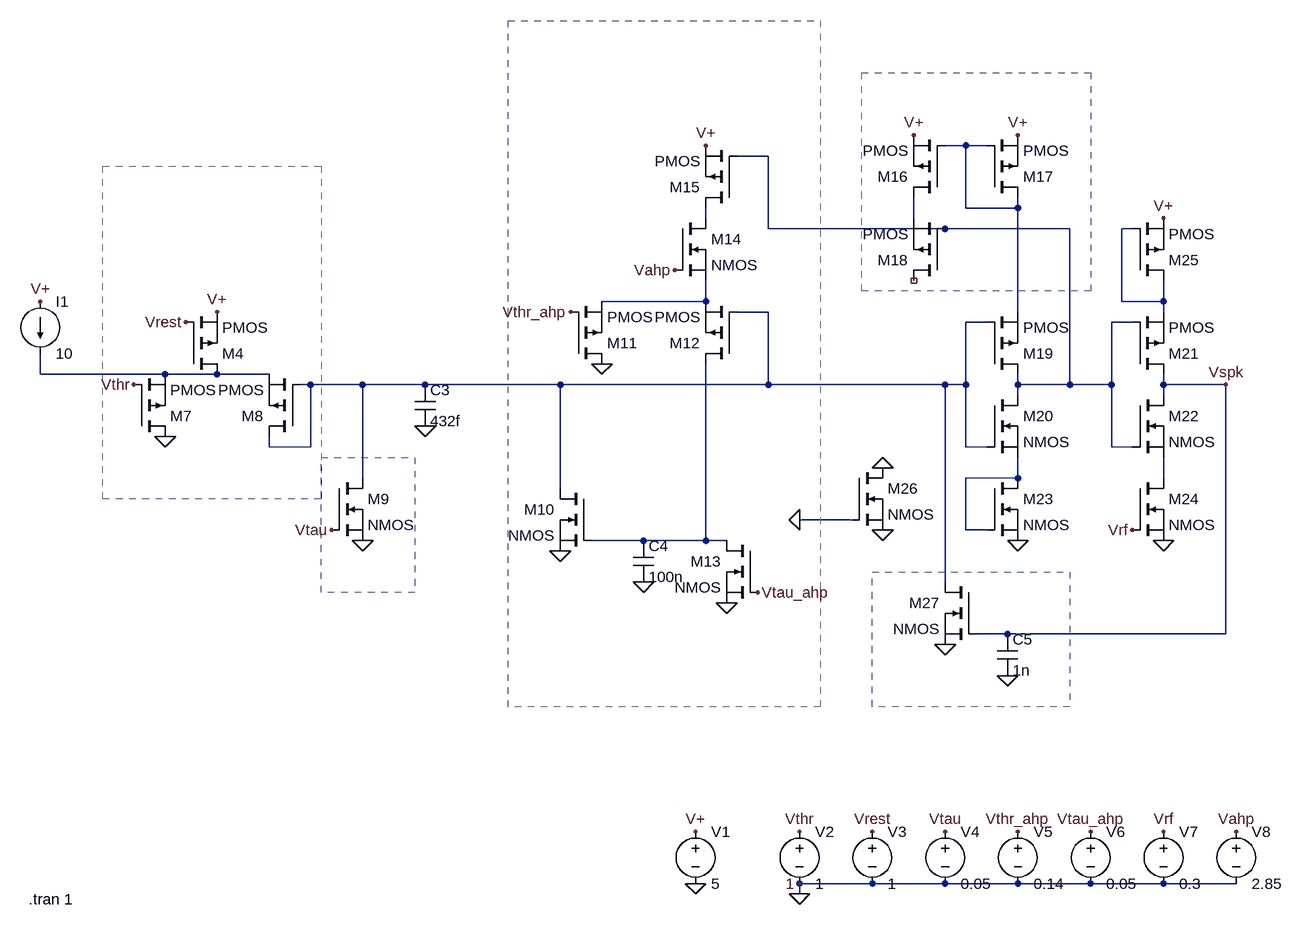
[diagram p0: schematic indiveri.asc]
indiveri.asc, the LTspice schematic file:
Version 4
SHEET 1 2744 860
WIRE 2256 -336 2224 -336
WIRE 2288 -336 2256 -336
WIRE 1952 -320 1904 -320
WIRE 2256 -240 2256 -336
WIRE 2336 -240 2336 -256
WIRE 2336 -240 2256 -240
WIRE 1856 -224 1856 -240
WIRE 2176 -224 2176 -256
WIRE 1952 -208 1952 -320
WIRE 2224 -208 1952 -208
WIRE 2416 -208 2224 -208
WIRE 2512 -208 2496 -208
WIRE 1856 -96 1856 -128
WIRE 1856 -96 1696 -96
WIRE 2496 -96 2496 -208
WIRE 2560 -96 2560 -128
WIRE 2560 -96 2496 -96
WIRE 1952 -80 1904 -80
WIRE 2336 -80 2336 -240
WIRE 2560 -80 2560 -96
WIRE 2288 -64 2256 -64
WIRE 2512 -64 2480 -64
WIRE 832 16 832 -16
WIRE 1024 16 832 16
WIRE 1104 16 1024 16
WIRE 1184 16 1104 16
WIRE 1248 32 1232 32
WIRE 1328 32 1248 32
WIRE 1424 32 1328 32
WIRE 1632 32 1424 32
WIRE 1952 32 1952 -80
WIRE 1952 32 1632 32
WIRE 2224 32 1952 32
WIRE 2256 32 2256 -64
WIRE 2256 32 2224 32
WIRE 2336 32 2336 16
WIRE 2416 32 2416 -208
WIRE 2416 32 2336 32
WIRE 2480 32 2480 -64
WIRE 2480 32 2416 32
WIRE 2560 32 2560 16
WIRE 2656 32 2560 32
WIRE 2336 48 2336 32
WIRE 2560 48 2560 32
WIRE 1184 128 1184 112
WIRE 1248 128 1248 32
WIRE 1248 128 1184 128
WIRE 2256 128 2256 32
WIRE 2288 128 2256 128
WIRE 2480 128 2480 32
WIRE 2512 128 2480 128
WIRE 1328 176 1328 32
WIRE 2336 176 2336 144
WIRE 2336 176 2256 176
WIRE 2560 176 2560 144
WIRE 1632 192 1632 32
WIRE 2080 240 2000 240
WIRE 2256 256 2256 176
WIRE 2288 256 2256 256
WIRE 1760 272 1680 272
WIRE 1856 272 1856 0
WIRE 1856 272 1760 272
WIRE 1888 272 1856 272
WIRE 2224 336 2224 32
WIRE 2320 416 2272 416
WIRE 2656 416 2656 32
WIRE 2656 416 2320 416
WIRE 2112 800 2000 800
WIRE 2224 800 2112 800
WIRE 2336 800 2224 800
WIRE 2448 800 2336 800
WIRE 2560 800 2448 800
WIRE 2672 800 2560 800
WIRE 2000 816 2000 800
FLAG 1424 96 0
FLAG 1760 336 0
FLAG 1888 368 0
FLAG 1632 288 0
FLAG 1696 0 0
FLAG 1024 112 0
FLAG 1328 272 0
FLAG 2336 272 0
FLAG 2560 272 0
FLAG 2128 256 0
FLAG 2224 432 0
FLAG 2320 480 0
FLAG 1840 800 0
FLAG 1840 720 V+
FLAG 832 -96 V+
FLAG 1104 -80 V+
FLAG 1856 -336 V+
FLAG 2176 -352 V+
FLAG 2336 -352 V+
FLAG 2560 -224 V+
FLAG 2128 160 0
FLAG 2000 800 1
FLAG 2000 720 Vthr
FLAG 2112 720 Vrest
FLAG 2224 720 Vtau
FLAG 2336 720 Vthr_ahp
FLAG 2448 720 Vtau_ahp
FLAG 2560 720 Vrf
FLAG 2672 720 Vahp
FLAG 976 32 Vthr
FLAG 1056 -64 Vrest
FLAG 1280 256 Vtau
FLAG 1648 -80 Vthr_ahp
FLAG 1936 352 Vtau_ahp
FLAG 2512 256 Vrf
FLAG 2656 32 Vspk
FLAG 1808 -144 Vahp
FLAG 2000 816 0
FLAG 2000 240 0
SYMBOL pmos 1056 16 M180
SYMATTR InstName M4
SYMBOL pmos 976 112 M180
SYMATTR InstName M7
SYMBOL pmos 1232 112 R180
SYMATTR InstName M8
SYMBOL nmos 1280 176 R0
SYMATTR InstName M9
SYMBOL nmos 1680 192 M0
SYMATTR InstName M10
SYMBOL pmos 1648 0 M180
SYMATTR InstName M11
SYMBOL pmos 1904 0 R180
SYMATTR InstName M12
SYMBOL cap 1408 32 R0
SYMATTR InstName C3
SYMATTR Value 432f
SYMBOL cap 1744 272 R0
SYMATTR InstName C4
SYMATTR Value 100n
SYMBOL nmos 1936 272 M0
SYMATTR InstName M13
SYMBOL nmos 1808 -224 R0
SYMATTR InstName M14
SYMBOL pmos 1904 -240 R180
SYMATTR InstName M15
SYMBOL pmos 2224 -256 R180
SYMATTR InstName M16
SYMBOL pmos 2288 -256 M180
SYMATTR InstName M17
SYMBOL pmos 2224 -128 R180
SYMATTR InstName M18
SYMBOL pmos 2288 16 M180
SYMATTR InstName M19
SYMBOL nmos 2288 48 R0
SYMATTR InstName M20
SYMBOL pmos 2512 16 M180
SYMATTR InstName M21
SYMBOL nmos 2512 48 R0
SYMATTR InstName M22
SYMBOL nmos 2288 176 R0
SYMATTR InstName M23
SYMBOL nmos 2512 176 R0
SYMATTR InstName M24
SYMBOL pmos 2512 -128 M180
SYMATTR InstName M25
SYMBOL nmos 2080 160 R0
SYMATTR InstName M26
SYMBOL nmos 2272 336 M0
SYMATTR InstName M27
SYMBOL cap 2304 416 R0
SYMATTR InstName C5
SYMATTR Value 1n
SYMBOL voltage 1840 704 R0
WINDOW 123 0 0 Left 2
WINDOW 39 0 0 Left 2
SYMATTR InstName V1
SYMATTR Value 5
SYMBOL current 832 -96 R0
WINDOW 123 0 0 Left 2
WINDOW 39 0 0 Left 2
SYMATTR InstName I1
SYMATTR Value 10
SYMBOL voltage 2000 704 R0
WINDOW 123 0 0 Left 2
WINDOW 39 0 0 Left 2
SYMATTR InstName V2
SYMATTR Value 1
SYMBOL voltage 2112 704 R0
WINDOW 123 0 0 Left 2
WINDOW 39 0 0 Left 2
SYMATTR InstName V3
SYMATTR Value 1
SYMBOL voltage 2224 704 R0
WINDOW 123 0 0 Left 2
WINDOW 39 0 0 Left 2
SYMATTR InstName V4
SYMATTR Value 0.05
SYMBOL voltage 2336 704 R0
WINDOW 123 0 0 Left 2
WINDOW 39 0 0 Left 2
SYMATTR InstName V5
SYMATTR Value 0.14
SYMBOL voltage 2448 704 R0
WINDOW 123 0 0 Left 2
WINDOW 39 0 0 Left 2
SYMATTR InstName V6
SYMATTR Value 0.05
SYMBOL voltage 2560 704 R0
WINDOW 123 0 0 Left 2
WINDOW 39 0 0 Left 2
SYMATTR InstName V7
SYMATTR Value 0.3
SYMBOL voltage 2672 704 R0
WINDOW 123 0 0 Left 2
WINDOW 39 0 0 Left 2
SYMATTR InstName V8
SYMATTR Value 2.85
TEXT 814 824 Left 2 !.tran 1
RECTANGLE Normal 2032 528 1552 -528 2
RECTANGLE Normal 2032 528 1552 -528 2
RECTANGLE Normal 2032 528 1552 -528 2
RECTANGLE Normal 1408 352 1264 144 2
RECTANGLE Normal 1264 208 928 -304 2
RECTANGLE Normal 2448 -112 2096 -448 2
RECTANGLE Normal 2416 528 2112 320 2

The netlist it stands for:
* indiveri.asc
M4 N008 Vrest V+ V+ PMOS
M7 0 Vthr N008 N008 PMOS
M8 N007 N007 N008 N008 PMOS
M9 N007 Vtau 0 0 NMOS
M10 N007 N011 0 0 NMOS
M11 0 Vthr_ahp N006 N006 PMOS
M12 N011 N007 N006 N006 PMOS
C3 N007 0 432f
C4 N011 0 100n
M13 N011 Vtau_ahp 0 0 NMOS
M14 N003 Vahp N006 N006 NMOS
M15 N003 N002 V+ V+ PMOS
M16 N004 N001 V+ V+ PMOS
M17 N001 N001 V+ V+ PMOS
M18 NC_01 N002 N004 N004 PMOS
M19 N002 N007 N001 N001 PMOS
M20 N002 N007 N009 N009 NMOS
M21 Vspk N002 N005 N005 PMOS
M22 Vspk N002 N010 N010 NMOS
M23 N009 N009 0 0 NMOS
M24 N010 Vrf 0 0 NMOS
M25 N005 N005 V+ V+ PMOS
M26 0 0 0 0 NMOS
M27 N007 Vspk 0 0 NMOS
C5 Vspk 0 1n
V1 V+ 0 5
I1 V+ N008 10
V2 Vthr 0 1
V3 Vrest 0 1
V4 Vtau 0 0.05
V5 Vthr_ahp 0 0.14
V6 Vtau_ahp 0 0.05
V7 Vrf 0 0.3
V8 Vahp 0 2.85
.model NMOS NMOS
.model PMOS PMOS
.lib standard.mos
.tran 1
.backanno
.end